# Altium schematic sheet STM32F3_DRV8323RS.SchDoc
size A2
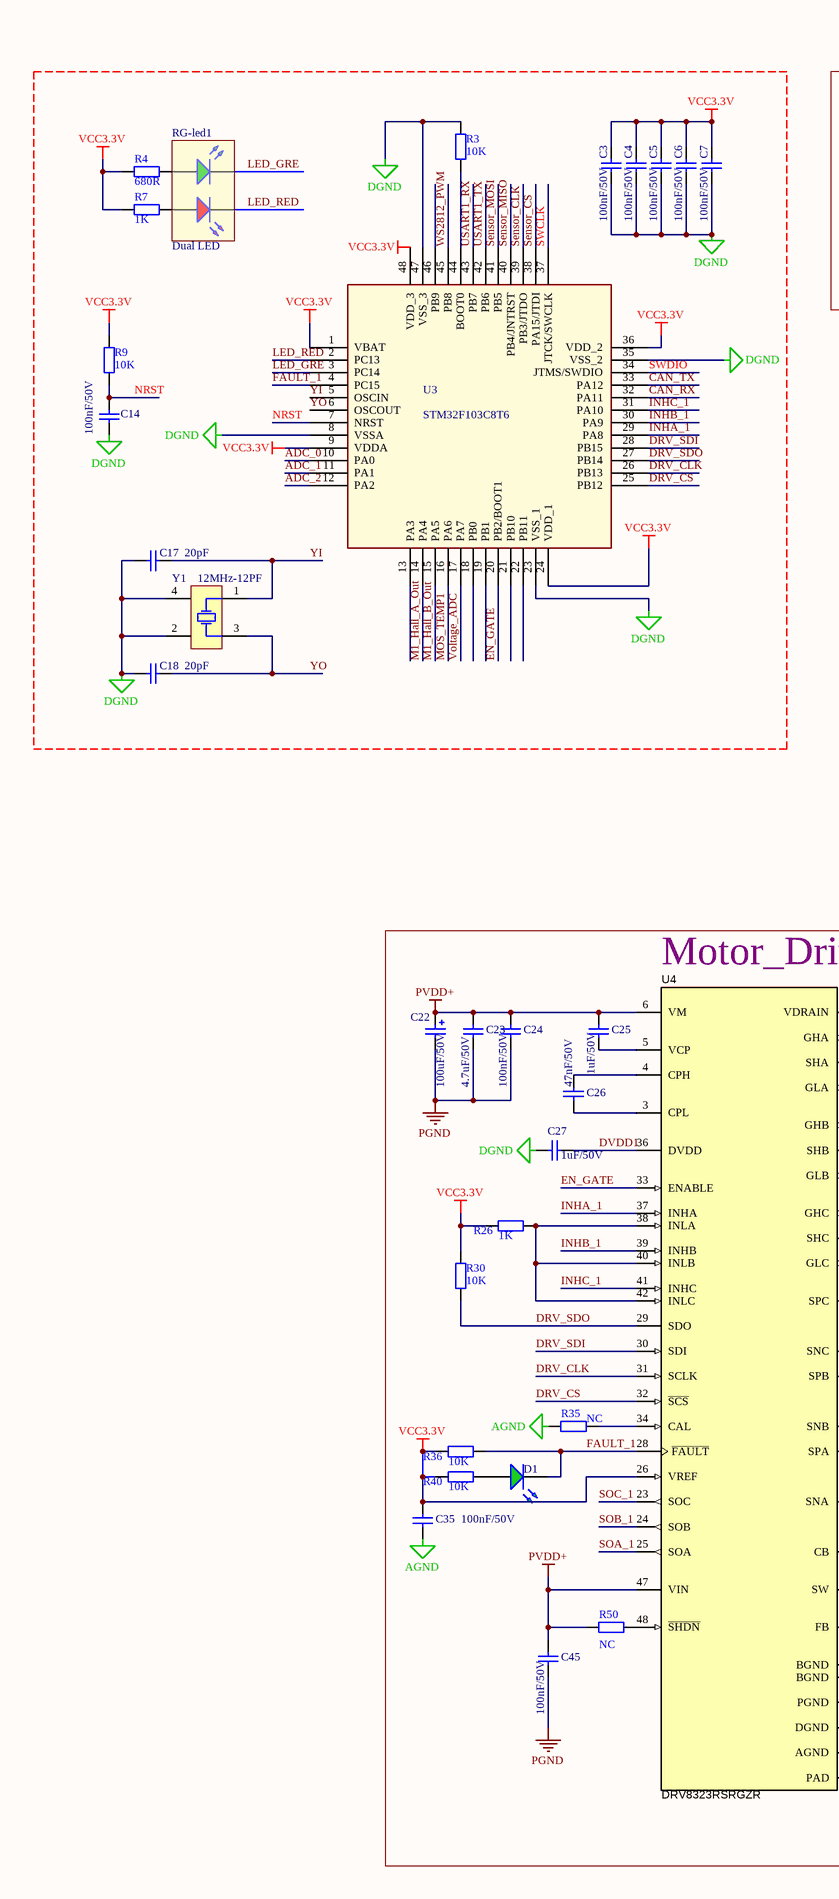
[diagram p0: STM32F3_DRV8323RS.SchDoc, left]
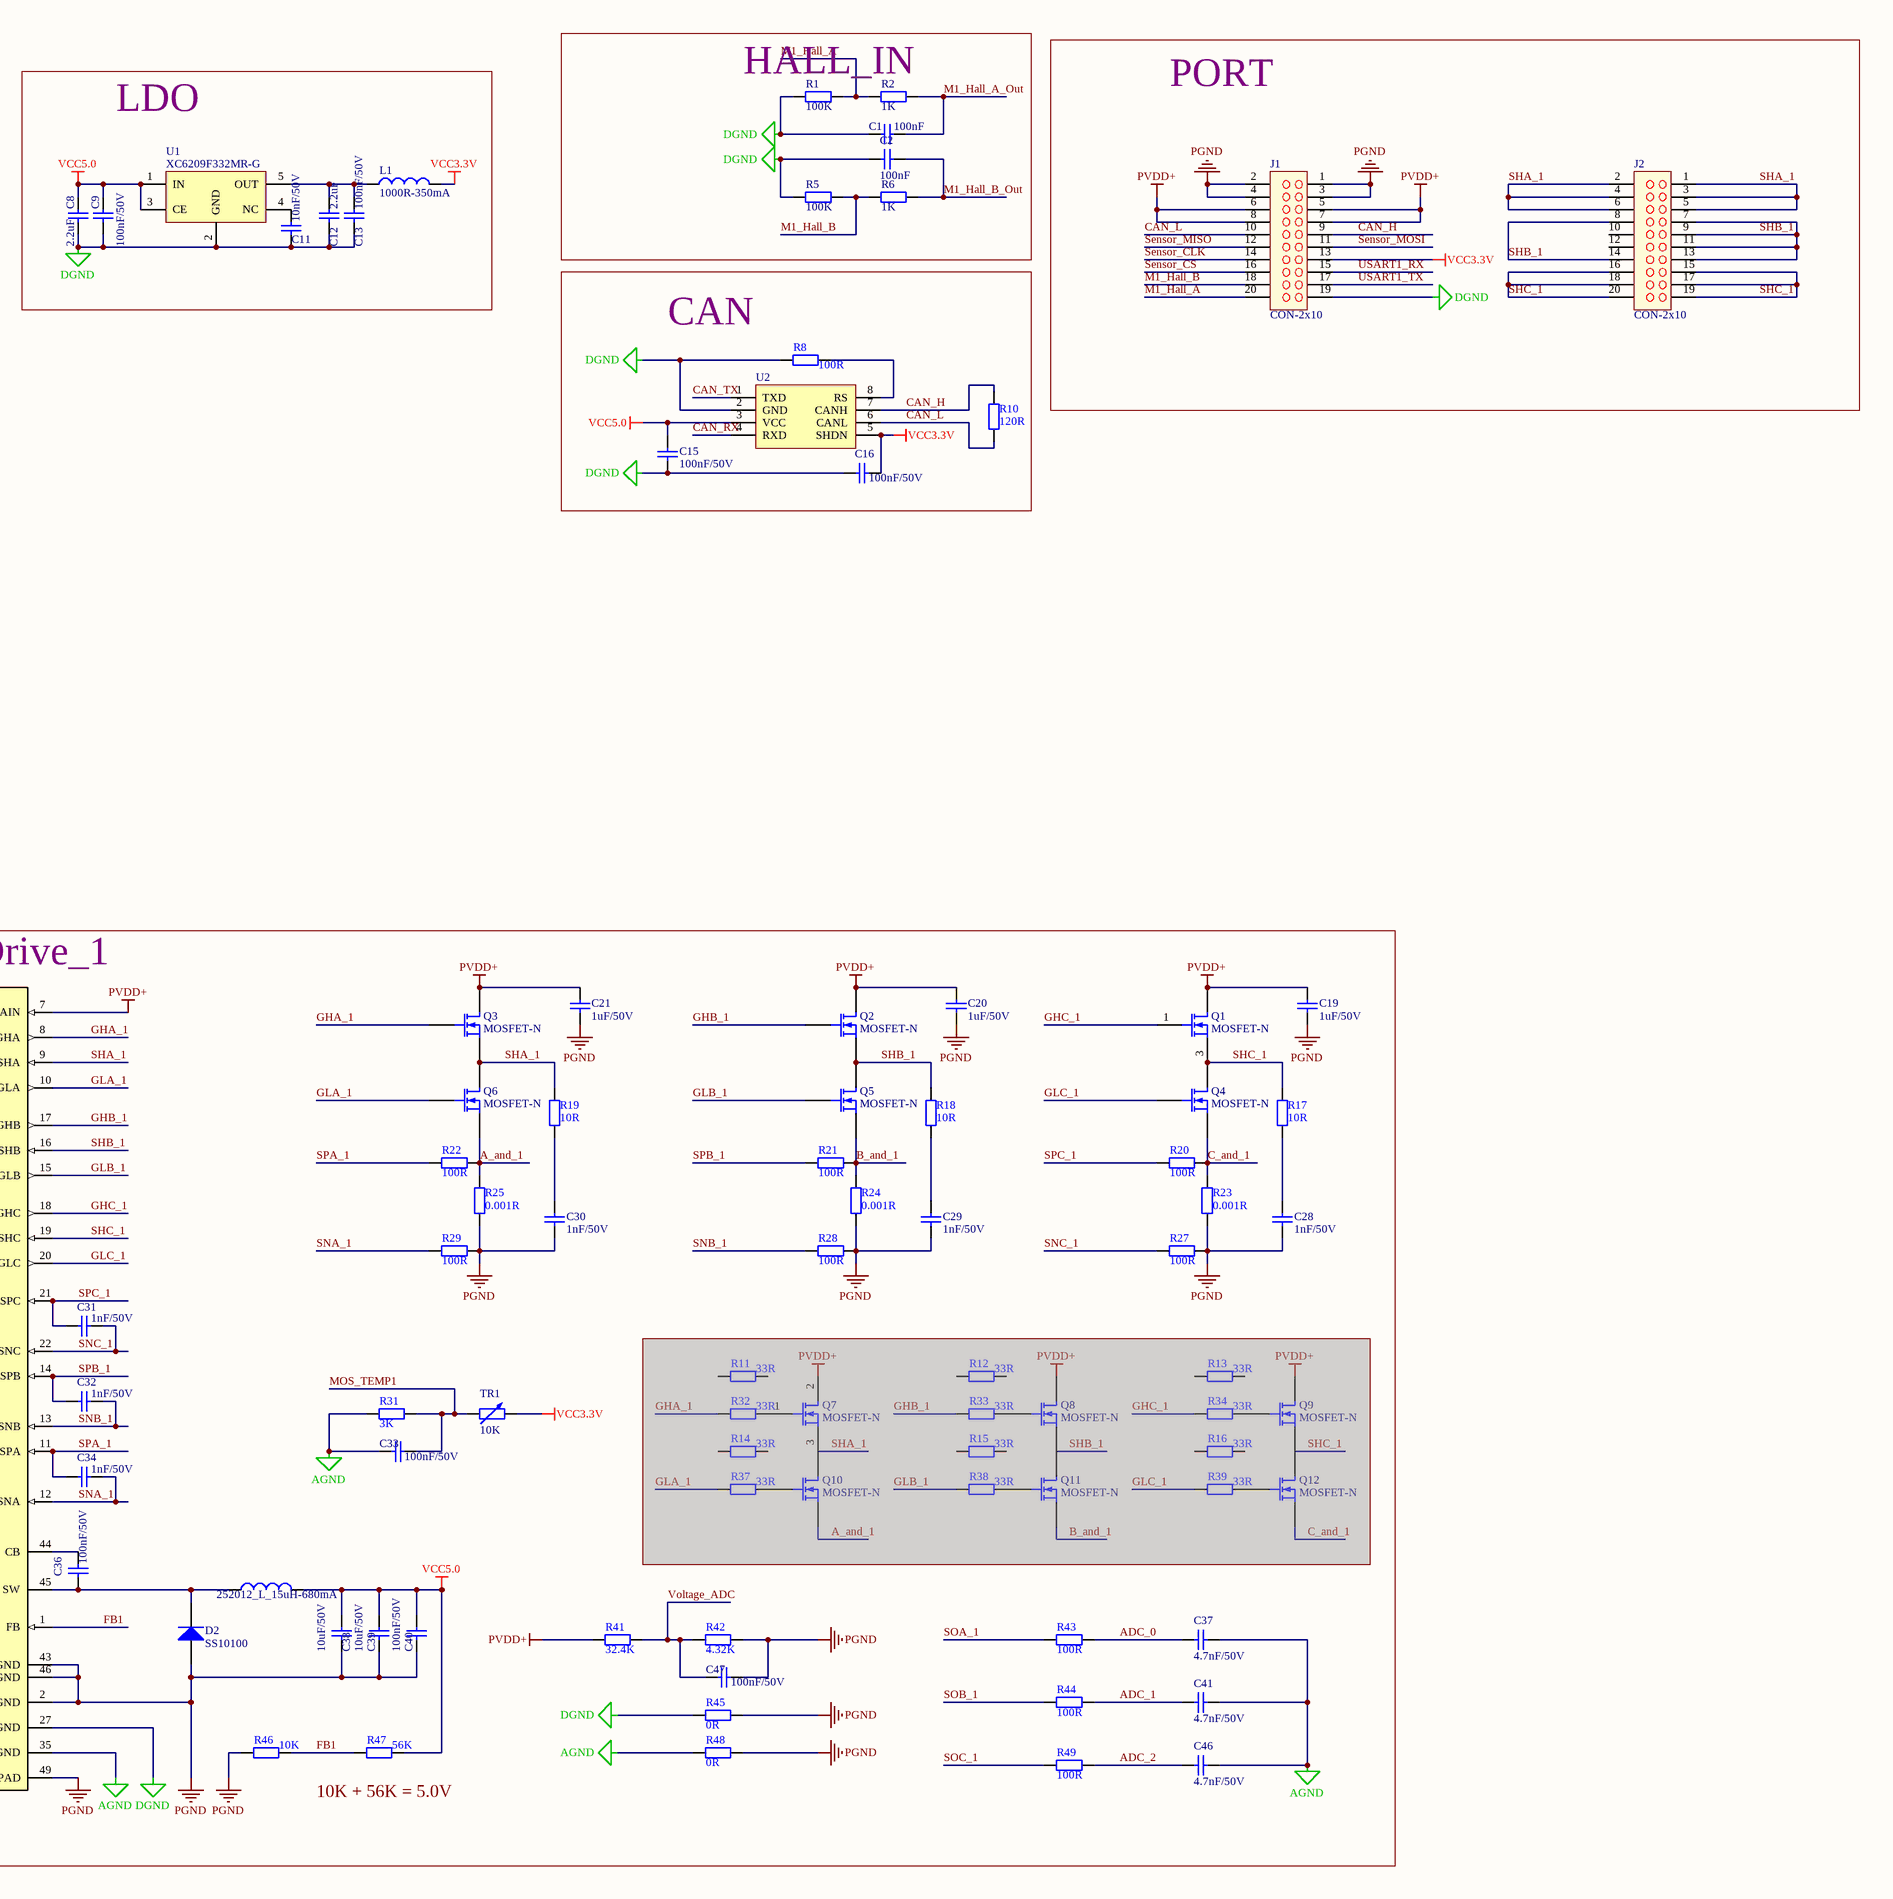
[diagram p1: STM32F3_DRV8323RS.SchDoc, right]

## Parts
C1  100nF  [0402_C]
C2  100nF  [0402_C]
C3  100nF/50V  [0402_C]
C4  100nF/50V  [0402_C]
C5  100nF/50V  [0402_C]
C6  100nF/50V  [0402_C]
C7  100nF/50V  [0402_C]
C8  2.2uF  [0402_C]
C9  100nF/50V  [0402_C]
C11  10nF/50V  [0402_C]
C12  2.2uF  [0402_C]
C13  100nF/50V  [0402_C]
C14  100nF/50V  [0402_C]
C15  100nF/50V  [0402_C]
C16  100nF/50V  [0402_C]
C17  20pF  [0402_C]
C18  20pF  [0402_C]
C19  1uF/50V  [0805_C]
C20  1uF/50V  [0805_C]
C21  1uF/50V  [0805_C]
C22  100uF/50V  [AEC_8X12.5_B]
C23  4.7uF/50V  [0805_C]
C24  100nF/50V  [0402_C]
C25  1uF/50V  [0402_C]
C26  47nF/50V  [0402_C]
C27  1uF/50V  [0402_C]
C28  1nF/50V  [0402_C]
C29  1nF/50V  [0402_C]
C30  1nF/50V  [0402_C]
C31  1nF/50V  [0402_C]
C32  1nF/50V  [0402_C]
C33  100nF/50V  [0402_C]
C34  1nF/50V  [0402_C]
C35  100nF/50V  [0402_C]
C36  100nF/50V  [0402_C]
C37  4.7nF/50V  [0402_C]
C38  10uF/50V  [0603_C]
C39  10uF/50V  [0603_C]
C40  100nF/50V  [0402_C]
C41  4.7nF/50V  [0402_C]
C45  100nF/50V  [0402_C]
C46  4.7nF/50V  [0402_C]
C47  100nF/50V  [0402_C]
D1  0603_D-CL-0603 URC-RED  [0603_D]  (value not drawn)
D2  SS10100  [SOD-123]
J1  CON-2x10  [CON-2x10]
J2  CON-2x10  [CON-2x10-A]
L1  1000R-350mA  [0402_L]
L2  252012_L_15uH-680mA  [INDU_4x4x1.8]
Q1  MOSFET-N  [DFN5X6]
Q2  MOSFET-N  [DFN5X6]
Q3  MOSFET-N  [DFN5X6]
Q4  MOSFET-N  [DFN5X6]
Q5  MOSFET-N  [DFN5X6]
Q6  MOSFET-N  [DFN5X6]
Q7  MOSFET-N  [DFN5X6]  (masked out: inside a compile mask, not in the netlist)
Q8  MOSFET-N  [DFN5X6]  (masked out: inside a compile mask, not in the netlist)
Q9  MOSFET-N  [DFN5X6]  (masked out: inside a compile mask, not in the netlist)
Q10  MOSFET-N  [DFN5X6]  (masked out: inside a compile mask, not in the netlist)
Q11  MOSFET-N  [DFN5X6]  (masked out: inside a compile mask, not in the netlist)
Q12  MOSFET-N  [DFN5X6]  (masked out: inside a compile mask, not in the netlist)
R1  100K  [0402_R]
R2  1K  [0402_R]
R3  10K  [0402_R]
R4  680R  [0402_R]
R5  100K  [0402_R]
R6  1K  [0402_R]
R7  1K  [0402_R]
R8  100R  [0402_R]
R9  10K  [0402_R]
R10  120R  [0603_R]
R11  33R  [0402_R]  (masked out: inside a compile mask, not in the netlist)
R12  33R  [0402_R]  (masked out: inside a compile mask, not in the netlist)
R13  33R  [0402_R]  (masked out: inside a compile mask, not in the netlist)
R14  33R  [0402_R]  (masked out: inside a compile mask, not in the netlist)
R15  33R  [0402_R]  (masked out: inside a compile mask, not in the netlist)
R16  33R  [0402_R]  (masked out: inside a compile mask, not in the netlist)
R17  10R  [0402_R]
R18  10R  [0402_R]
R19  10R  [0402_R]
R20  100R  [0402_R]
R21  100R  [0402_R]
R22  100R  [0402_R]
R23  0.001R  [2512_R]
R24  0.001R  [2512_R]
R25  0.001R  [2512_R]
R26  1K  [0402_R]
R27  100R  [0402_R]
R28  100R  [0402_R]
R29  100R  [0402_R]
R30  10K  [0402_R]
R31  3K  [0402_R]
R32  33R  [0402_R]  (masked out: inside a compile mask, not in the netlist)
R33  33R  [0402_R]  (masked out: inside a compile mask, not in the netlist)
R34  33R  [0402_R]  (masked out: inside a compile mask, not in the netlist)
R35  NC  [0402_R]
R36  10K  [0402_R]
R37  33R  [0402_R]  (masked out: inside a compile mask, not in the netlist)
R38  33R  [0402_R]  (masked out: inside a compile mask, not in the netlist)
R39  33R  [0402_R]  (masked out: inside a compile mask, not in the netlist)
R40  10K  [0402_R]
R41  32.4K  [0402_R]
R42  4.32K  [0402_R]
R43  100R  [0402_R]
R44  100R  [0402_R]
R45  0R  [0603_R]
R46  10K  [0402_R]
R47  56K  [0402_R]
R48  0R  [0603_R]
R49  100R  [0402_R]
R50  NC  [0402_R]
RG-led1  Dual LED  [0603_Dx2]
TR1  10K  [0402_R]
U1  XC6209F332MR-G  [SOT23-5]
U2  1042  [SOP-8]  (value not drawn)
U3  STM32F103C8T6  [LQFP-48]
U4  DRV8323RSRGZR  [RGZ0048B]
Y1  12MHz-12PF  [XTAL_SMD_3.2X2.5_4P]

## Blocks framed on the sheet
LDO: C8 C9 C11-C13 L1 U1
HALL_IN: C1 C2 R1 R2 R5 R6
PORT: J1 J2
CAN: C15 C16 R8 R10 U2
Motor_Drive_1: C19-C41 C45-C47 D1 D2 L2 Q1-Q12 R11-R50 TR1 U4

## Nets
AGND: C33.2 C35.1 C37.2 C41.2 C46.2 R31.1 R35.1 R48.1 U4.35(AGND)
DGND: C1.1 C2.1 C3.2 C4.2 C5.2 C6.2 C7.1 C8.2 C9.2 C11.1 C12.2 C13.2 C14.2 C15.2 C16.1 C17.2 C18.2 C27.2 J1.19 R1.1 R3.1 R5.1 R8.2 R45.1 U1.2(GND) U2.2(GND) U3.8(VSSA) U3.23(VSS_1) U3.35(VSS_2) U3.47(VSS_3) U4.27(DGND) Y1.2 Y1.4
PGND: C19.2 C20.2 C21.2 C22.2 C23.1 C24.1 C28.2 C29.2 C30.2 C38.2 C39.2 C40.1 C45.1 C47.1 D2.1(A) J1.1 J1.2 J1.3 J1.4 R23.2 R24.2 R25.2 R27.1 R28.1 R29.1 R42.2 R45.2 R46.1 R48.2 U4.2(PGND) U4.43(BGND) U4.46(BGND) U4.49(PAD)
PVDD+: C19.1 C20.1 C21.1 C22.1 C23.2 C24.2 C25.2 C45.2 J1.5 J1.6 J1.7 J1.8 Q1.2(D) Q2.2(D) Q3.2(D) R41.1 R50.1 U4.6(VM) U4.7(VDRAIN) U4.47(VIN)
VCC3.3V: C3.1 C4.1 C5.1 C6.1 C7.2 C16.2 C35.2 J1.13 L1.2 R4.2 R7.2 R9.1 R26.2 R30.2 R36.2 R40.2 TR1.2 U2.5(SHDN) U3.1(VBAT) U3.9(VDDA) U3.24(VDD_1) U3.36(VDD_2) U3.48(VDD_3) U4.26(VREF)
VCC5.0: C8.1 C9.1 C15.1 C38.1 C39.1 C40.2 L2.2 R47.2 U1.1(IN) U1.3(CE) U2.3(VCC)
A_and_1: Q6.3(S) R22.1 R25.1
ADC_0: C37.1 R43.1 U3.10(PA0)
ADC_1: C41.1 R44.1 U3.11(PA1)
ADC_2: C46.1 R49.1 U3.12(PA2)
B_and_1: Q5.3(S) R21.1 R24.1
C_and_1: Q4.3(S) R20.1 R23.1
CAN_H: J1.9 R10.1 U2.7(CANH)
CAN_L: J1.10 R10.2 U2.6(CANL)
CAN_RX: U2.4(RXD) U3.32(PA11)
CAN_TX: U2.1(TXD) U3.33(PA12)
DRV_CLK: U3.26(PB13) U4.31(SCLK)
DRV_CS: U3.25(PB12) U4.32(~{SCS})
DRV_SDI: U3.28(PB15) U4.30(SDI)
DRV_SDO: R30.1 U3.27(PB14) U4.29(SDO)
DVDD1: C27.1 U4.36(DVDD)
EN_GATE: U3.20(PB2/BOOT1) U4.33(ENABLE)
FAULT_1: D1.2(K) R36.1 U3.4(PC15) U4.28(~{FAULT})
FB1: R46.2 R47.1 U4.1(FB)
GHA_1: Q3.1(G) U4.8(GHA)
GHB_1: Q2.1(G) U4.17(GHB)
GHC_1: Q1.1(G) U4.18(GHC)
GLA_1: Q6.1(G) U4.10(GLA)
GLB_1: Q5.1(G) U4.15(GLB)
GLC_1: Q4.1(G) U4.20(GLC)
INHA_1: U3.29(PA8) U4.37(INHA)
INHB_1: U3.30(PA9) U4.39(INHB)
INHC_1: U3.31(PA10) U4.41(INHC)
LED_GRE: RG-led1.4(K) U3.3(PC14)
LED_RED: RG-led1.2(K) U3.2(PC13)
M1_Hall_A: J1.20 R1.2 R2.2
M1_Hall_A_Out: C1.2 R2.1 U3.14(PA4)
M1_Hall_B: J1.18 R5.2 R6.2
M1_Hall_B_Out: C2.2 R6.1 U3.15(PA5)
MOS_TEMP1: C33.1 R31.2 TR1.1 U3.16(PA6)
NRST: C14.1 R9.2 U3.7(NRST)
Sensor_CLK: J1.14 U3.39(PB3/JTDO)
Sensor_CS: J1.16 U3.38(PA15/JTDI)
Sensor_MISO: J1.12 U3.40(PB4/JNTRST)
Sensor_MOSI: J1.11 U3.41(PB5)
SHA_1: J2.1 J2.2 J2.3 J2.4 J2.5 J2.6 Q3.3(S) Q6.2(D) R19.1 U4.9(SHA)
SHB_1: J2.7 J2.8 J2.9 J2.11 J2.13 J2.14 Q2.3(S) Q5.2(D) R18.1 U4.16(SHB)
SHC_1: J2.15 J2.16 J2.17 J2.18 J2.19 J2.20 Q1.3(S) Q4.2(D) R17.1 U4.19(SHC)
SNA_1: C34.1 R29.2 U4.12(SNA)
SNB_1: C32.1 R28.2 U4.13(SNB)
SNC_1: C31.1 R27.2 U4.22(SNC)
SOA_1: R43.2 U4.25(SOA)
SOB_1: R44.2 U4.24(SOB)
SOC_1: R49.2 U4.23(SOC)
SPA_1: C34.2 R22.2 U4.11(SPA)
SPB_1: C32.2 R21.2 U4.14(SPB)
SPC_1: C31.2 R20.2 U4.21(SPC)
SWCLK: U3.37(JTCK/SWCLK)
SWDIO: U3.34(JTMS/SWDIO)
USART1_RX: J1.15 U3.43(PB7)
USART1_TX: J1.17 U3.42(PB6)
Voltage_ADC: C47.2 R41.2 R42.1 U3.17(PA7)
WS2812_PWM: U3.45(PB8)
YI: C17.1 U3.5(OSCIN) Y1.1
YO: C18.1 U3.6(OSCOUT) Y1.3
NetC11_2: C11.2 U1.4(NC)
NetC12_1: C12.1 C13.1 L1.1 U1.5(OUT)
NetC25_1: C25.1 U4.5(VCP)
NetC26_1: C26.1 U4.3(CPL)
NetC26_2: C26.2 U4.4(CPH)
NetC28_1: C28.1 R17.2
NetC29_1: C29.1 R18.2
NetC30_1: C30.1 R19.2
NetC36_1: C36.1 D2.2(K) L2.1 U4.45(SW)
NetC36_2: C36.2 U4.44(CB)
NetD1_1: D1.1(A) R40.1
NetR3_2: R3.2 U3.44(BOOT0)
NetR4_1: R4.1 RG-led1.3(A)
NetR7_1: R7.1 RG-led1.1(A)
NetR8_1: R8.1 U2.8(RS)
NetR26_1: R26.1 U4.38(INLA) U4.40(INLB) U4.42(INLC)
NetR35_2: R35.2 U4.34(CAL)
NetR50_2: R50.2 U4.48(~{SHDN})

Not connected (* = marked no-connect by the designer): J2 10 12; U3 13(PA3) 18(PB0) 19(PB1) 21(PB10) 22(PB11) 46(PB9)

## Notes on the sheet
- 10K + 56K = 5.0V

## Library data of the parts
C1-C7 C11 C15 C16 C23-C27 C31 C32 C34-C36 C38-C40 C45 = Cap: Capacitor; Published: 8-Jun-2000; LatestRevisionDate: 17-Jul-2002; LatestRevisionNote: Re-released for DXP Platform.; PackageReference: RAD-0.3; Publisher: Altium Limited
  C1 C2: Value: 100nF
C8 C9 C12-C14 C17-C21 C28-C30 C33 C37 C41 C46 C47 = Cap: Capacitor; Value: 100nF; Published: 8-Jun-2000; LatestRevisionDate: 17-Jul-2002; LatestRevisionNote: Re-released for DXP Platform.; PackageReference: RAD-0.3; Publisher: Altium Limited
C22 = Cap Pol: Polarized Capacitor (Radial); Published: 8-Jun-2000; LatestRevisionDate: 17-Jul-2002; LatestRevisionNote: Re-released for DXP Platform.; PackageReference: RB7.6-15; Publisher: Altium Limited
D1 = LED: value: BH-27-21/R6C-AP1Q2B/3C
D2 = Diode: DIODE SWITCHING 75V 0.15A SOD523; Manufacturer: Micro Commercial; DK Part Number: 1N4148XTPMSTR-ND; MFG Part Number: 1N4148X-TP; Value: 1n4148; Voltage: 75V; Part Description: DIODE SWITCHING 75V 0.15A SOD523
L1 = Inductor: Code_IEC: 1005; Value: BLM15AX102SN1; Published: 8-Jun-2000; LatestRevisionDate: 17-Jul-2002; LatestRevisionNote: Re-released for DXP Platform.; PackageReference: 0402-A; Publisher: Altium Limited; Code_JEITA: 0402
L2 = Inductor: Code_IEC: 1005; Published: 8-Jun-2000; LatestRevisionDate: 17-Jul-2002; LatestRevisionNote: Re-released for DXP Platform.; PackageReference: 0402-A; Publisher: Altium Limited; Code_JEITA: 0402
Q1-Q12 = MOSFET-N: N-Channel MOSFET
R1 R2 R5 R6 = Res: Resistor
R3 R4 R8-R25 R27-R50 = Res2: Resistor; Value: 1K; Published: 8-Jun-2000; LatestRevisionDate: 17-Jul-2002; LatestRevisionNote: Re-released for DXP Platform.; PackageReference: AXIAL-0.4; Publisher: Altium Limited
R7 R26 = Res2: Resistor; Published: 8-Jun-2000; LatestRevisionDate: 17-Jul-2002; LatestRevisionNote: Re-released for DXP Platform.; PackageReference: AXIAL-0.4; Publisher: Altium Limited; Value: 1K
TR1 = Res Adj2: Variable Resistor; Value: 1K; Set Position: 0.5; Published: 8-Jun-2000; LatestRevisionDate: 17-Jul-2002; LatestRevisionNote: Re-released for DXP Platform.; PackageReference: AXIAL-0.6; Publisher: Altium Limited
U1 = XC6228D332VR-G
U2 = MAX3051
U3 = STM32F103CBT6
U4 = DRV8323RSRGZR: 60-V Three-Phase Smart Gate Driver, RGZ0048B; Alternate PartNumber: DRV8323RSRGZT; Manufacturer: Texas Instruments; SymbolCreator: Altium; CompType: IC; U/M: EA; SymbolVersion: 2016-03-15; PartNumber: DRV8323RSRGZR; PackageReference: RGZ0048B; MountType: SMT; ComponentLink1Description: Datasheet Link; ComponentLink1URL: https://sps06.itg.ti.com/sites/KMS/crossdivteams/altium/docs/ComponentDatasheets/DRV832x_031016.pdf; RoHS: Y; Publisher: Texas Instruments; LatestRevisionDate: 2016-03-21; Alternate Manufacturer: Texas Instruments
Y1 = XTAL-4P